# EasyEDA Pro project main_control.eprj

# Schematic main_control
Board Name: main_control; Create Date: 2024-08-07; Page Name: SCH_main_control; Project Name: main_control; Schematic Name: main_control; Update Date: 2024-08-19; Add into BOM: yes; Convert to PCB: yes; Date: 2024-08-03; Draw By: LBZ; REV: 1.0; Sheet: 1/1
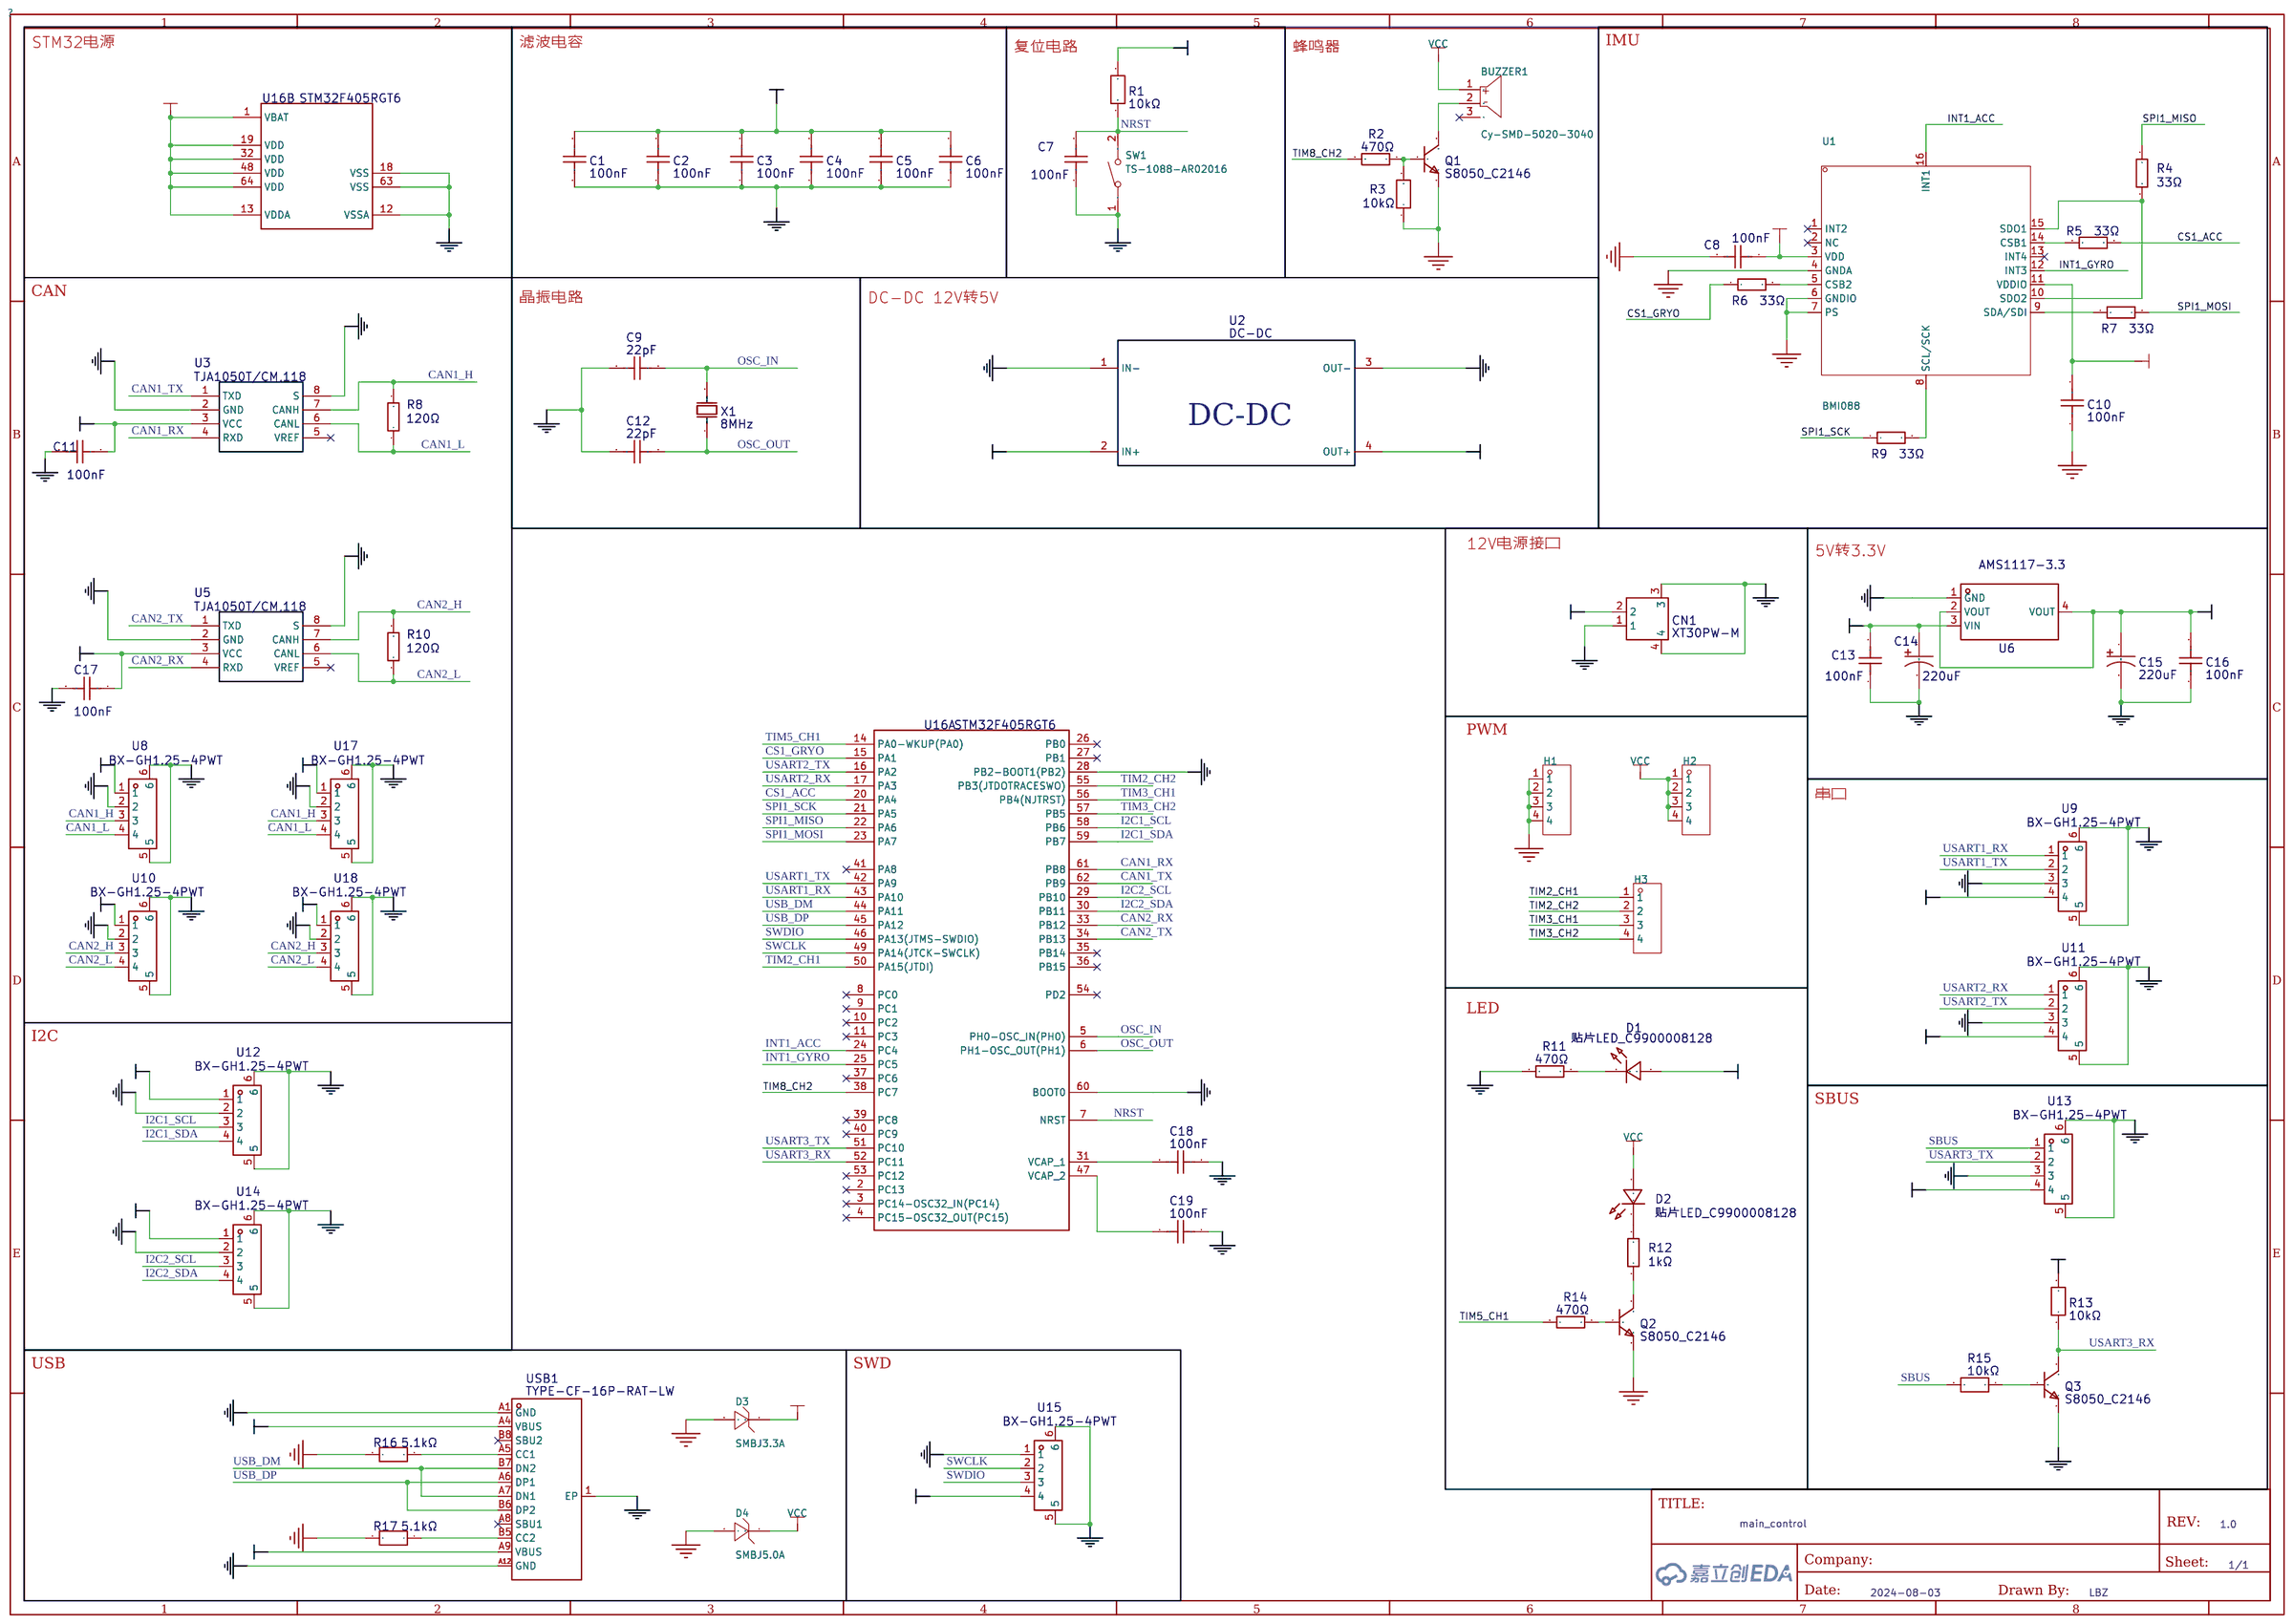
[diagram p0: schematic sheet]

## Parts
BUZZER1  Cy-SMD-5020-3040  [BUZ-SMD_CY-SMD-5020-3040]
C1  100nF  [C0603]
C2  100nF  [C0603]
C3  100nF  [C0603]
C4  100nF  [C0603]
C5  100nF  [C0603]
C6  100nF  [C0603]
C7  100nF  [C0603]
C8  100nF  [C0603]
C9  22pF  [C0603]
C10  100nF  [C0603]
C11  100nF  [C0603]
C12  22pF  [C0603]
C13  100nF  [C0603]
C14  220uF  [CAP-SMD_BD6.3-L6.6-W6.6-FD]
C15  220uF  [CAP-SMD_BD6.3-L6.6-W6.6-FD]
C16  100nF  [C0603]
C17  100nF  [C0603]
C18  100nF  [C0603]
C19  100nF  [C0603]
CN1  XT30PW-M  [CONN-TH_XT30PW-M]
D1  贴片LED_C9900008128  [LED0603-RD]
D2  贴片LED_C9900008128  [LED0603-RD]
D3  SMBJ3.3A  [SMB_L4.6-W3.6-LS5.3-RD]
D4  SMBJ5.0A  [SMB_L4.6-W3.6-LS5.3-RD]
H1  KH-2.54PH180-1X4P-L11.5  [HDR-TH_4P-P2.54-V-M]
H2  KH-2.54PH180-1X4P-L11.5  [HDR-TH_4P-P2.54-V-M]
H3  KH-2.54PH180-1X4P-L11.5  [HDR-TH_4P-P2.54-V-M]
Q1  S8050_C2146  [SOT-23-3_L3.0-W1.7-P0.95-LS2.9-BR]
Q2  S8050_C2146  [SOT-23-3_L3.0-W1.7-P0.95-LS2.9-BR]
Q3  S8050_C2146  [SOT-23-3_L3.0-W1.7-P0.95-LS2.9-BR]
R1  10kΩ  [R0603]
R2  470Ω  [R0805]
R3  10kΩ  [R0603]
R4  33Ω  [R0805]
R5  33Ω  [R0805]
R6  33Ω  [R0805]
R7  33Ω  [R0805]
R8  120Ω  [R0805]
R9  33Ω  [R0805]
R10  120Ω  [R0805]
R11  470Ω  [R0805]
R12  1kΩ  [R0805]
R13  10kΩ  [R0603]
R14  470Ω  [R0805]
R15  10kΩ  [R0603]
R16  5.1kΩ  [R0603]
R17  5.1kΩ  [R0603]
SW1  TS-1088-AR02016  [SW-SMD_L3.9-W3.0-P4.45]
U1  BMI088  [LGA-16_L4.5-W3.0-P0.50-BL]
U2  DC-DC  [DC-DC]
U3  TJA1050T/CM,118  [SOIC-8_L5.0-W4.0-P1.27-LS6.0-BL]
U5  TJA1050T/CM,118  [SOIC-8_L5.0-W4.0-P1.27-LS6.0-BL]
U6  AMS1117-3.3  [SOT-223-3_L6.5-W3.4-P2.30-LS7.0-BR]
U8  BX-GH1.25-4PWT  [CONN-SMD_4P-P1.25_BX-GH1.25-4PWT]
U9  BX-GH1.25-4PWT  [CONN-SMD_4P-P1.25_BX-GH1.25-4PWT]
U10  BX-GH1.25-4PWT  [CONN-SMD_4P-P1.25_BX-GH1.25-4PWT]
U11  BX-GH1.25-4PWT  [CONN-SMD_4P-P1.25_BX-GH1.25-4PWT]
U12  BX-GH1.25-4PWT  [CONN-SMD_4P-P1.25_BX-GH1.25-4PWT]
U13  BX-GH1.25-4PWT  [CONN-SMD_4P-P1.25_BX-GH1.25-4PWT]
U14  BX-GH1.25-4PWT  [CONN-SMD_4P-P1.25_BX-GH1.25-4PWT]
U15  BX-GH1.25-4PWT  [CONN-SMD_4P-P1.25_BX-GH1.25-4PWT]
U16  STM32F405RGT6  [LQFP-64_L10.0-W10.0-P0.50-LS12.0-BL]  (sections 1,2)
U17  BX-GH1.25-4PWT  [CONN-SMD_4P-P1.25_BX-GH1.25-4PWT]
U18  BX-GH1.25-4PWT  [CONN-SMD_4P-P1.25_BX-GH1.25-4PWT]
USB1  TYPE-CF-16P-RAT-LW  [TYPE-C-SMD_TYPE-CF-16P-RAT-LW]
X1  8MHz  [HC-49US_L11.5-W4.5-P4.88]

## Library data of the parts
BUZZER1 = Cy-SMD-5020-3040: LCSC Part Name: 电磁式无源蜂鸣器; Supplier Part: C968743; Manufacturer: CY(超音); Supplier Footprint: SMD,5x5mm; JLCPCB Part Class: 扩展库; Datasheet: https://atta.szlcsc.com/upload/public/pdf/source/20201211/C968743_12341BB1A92EB878772B5F362B4887DE.pdf; Supplier: LCSC
C1-C8 C10 C11 C13 C16-C19 = 100nF: Supplier: LCSC; Supplier Part: C2266794; Manufacturer: Knowles(楼氏); Manufacturer Part: 0603J0250104KXR; JLCPCB Part Class: Extended Part
C9 C12 = 22pF: Supplier: LCSC; Supplier Part: C2266794; Manufacturer: Knowles(楼氏); Manufacturer Part: 0603J0250104KXR; JLCPCB Part Class: Extended Part
C14 C15 = 220uF: Supplier: LCSC; Supplier Part: C165593; Manufacturer: SAMYOUNG(韩国三莹); Manufacturer Part: MVK 16V220M 6.3*8 6.3TP; JLCPCB Part Class: Extended Part
CN1 = XT30PW-M: Supplier: LCSC; Supplier Part: C431092; Manufacturer: AMASS(艾迈斯); JLCPCB Part Class: Extended Part
D1 D2 = 贴片LED_C9900008128: Supplier: LCSC; Supplier Part: C9900008128; Manufacturer: null; Manufacturer Part: 贴片LED
D3 = SMBJ3.3A_C362089: LCSC Part Name: 单向TVS 3.3V截止 600W峰值脉冲功率; Supplier Part: C113974; Manufacturer: JKSEMI(金开盛); Supplier Footprint: SMB(DO-214AA); JLCPCB Part Class: 扩展库; Datasheet: https://atta.szlcsc.com/upload/public/pdf/source/20200731/C362089_3B984BF84356FE4A5051ADB3F5B1E766.pdf; Supplier: LCSC; Reverse Stand-Off Voltage (Vrwm): 3.3V; Maximum Clamping Voltage: 7.3V; Peak Pulse Power Dissipation (Ppp)@10/1000us: 600W; Breakdown Voltage: 4.1V; Type: TVS
D4 = SMBJ5.0A_C113974: LCSC Part Name: TVS 5V截止 65.22A峰值脉冲; Supplier Part: C113974; Manufacturer: MDD; Supplier Footprint: SMB(DO-214AA); JLCPCB Part Class: 扩展库; Datasheet: https://atta.szlcsc.com/upload/public/pdf/source/20230314/C8F66EF07395B88C11214ABD10019202.pdf; Supplier: LCSC; Reverse Stand-Off Voltage (Vrwm): 5V; Maximum Clamping Voltage: 9.2V; Peak Pulse Current (Ipp)@10/1000us: 65.2A; Breakdown Voltage: 6.4V; Type: TVS
H1-H3 = KH-2.54PH180-1X4P-L11.5: LCSC Part Name: 间距:2.54mm 1x4P 直插 方针; Supplier Part: C2905435; Manufacturer: kinghelm(金航标); Supplier Footprint: 插件,P=2.54mm; JLCPCB Part Class: 扩展库; Datasheet: https://atta.szlcsc.com/upload/public/pdf/source/20211019/06FD9EA041E66F176E900F61FE678D35.pdf; Supplier: LCSC; Pin Structure: 1x4P; Pitch: 2.54mm; Circluar Pins/Square Pins: 方针; Mounting Type: 直插; Number of Rows: 单排; Number of Pins: 4P; Current Rating (Max): 3A; Length of Mating Pin: 6mm; Insulation Height: 2.5mm; Length of End Connection Pin: 3mm; Operating Temperature Range: -40℃~+105℃; Color: 黑色
Q1-Q3 = S8050_C2146: Supplier: LCSC; Manufacturer: CJ(江苏长电/长晶); Manufacturer Part: S8050 J3Y; Supplier Part: C2146; JLCPCB Part Class: Basic Part
R1 R3 R13 R15-R17 = 10kΩ: Supplier: LCSC; Supplier Part: C20138101; Manufacturer: VISHAY(威世); Manufacturer Part: MCT0603MG1002BP500; JLCPCB Part Class: Extended Part
R2 R4-R7 R9 R11 R12 R14 = 1kΩ: Supplier: LCSC; Manufacturer: YAGEO(国巨); Manufacturer Part: RC0805FR-07120RL; Supplier Part: C114245; JLCPCB Part Class: Extended Part
R8 R10 = 120Ω: Supplier: LCSC; Manufacturer: YAGEO(国巨); Manufacturer Part: RC0805FR-07120RL; Supplier Part: C114245; JLCPCB Part Class: Extended Part
SW1 = TS-1088-AR02016: LCSC Part Name: 4*3*2mm 立贴 轻触开关; Supplier Part: C720477; Manufacturer: XUNPU(讯普); Supplier Footprint: SMD; JLCPCB Part Class: 扩展库; Datasheet: https://atta.szlcsc.com/upload/public/pdf/source/20200810/C720475_60D09DD6C54279ADDB2DC25100F1CC11.pdf; Supplier: LCSC; Circuit: 单刀单掷; Actuator Style: 圆形按钮; Operating Force: 160gf; Mounting Style: 立贴; Switch Length: 4mm; Switch Width: 3mm; Switch Height: 2mm; Strike Gundam: 不带; Contact Current: 50mA; Voltage Rating (DC): 12V; Insulation Resistance: 100MΩ; Actuator/Cap Color: 黑色; Pin Style: SMD接片; Mechanical Life: 10万次; Operating Temperature: -30℃~+80℃
U1 = BMI088: Supplier Part: C194919; Manufacturer: Bosch(博世); Supplier Footprint: LGA-16(3x4.5); JLCPCB Part Class: 扩展库; Datasheet: https://atta.szlcsc.com/upload/public/pdf/source/20180628/C194919_66CCF125FF968C218A4D358C68AC68D6.pdf; Supplier: LCSC; Sensor Type: 加速度计陀螺仪; Operating Temperature: -40℃~+85℃
U2 = DC-DC: Supplier Part: C2875440
U3 U5 = TJA1050T/CM,118: Supplier: LCSC; Manufacturer: NXP(恩智浦); Supplier Part: C6952; JLCPCB Part Class: Extended Part
U6 = AMS1117-3.3: Supplier: LCSC; Manufacturer: AMS; Supplier Part: C6186; JLCPCB Part Class: Basic Part
U8-U15 U17 U18 = BX-GH1.25-4PWT: Supplier: LCSC; Supplier Part: C18077720; Manufacturer: Bossie(博锡); JLCPCB Part Class: Extended Part
U16 = STM32F405RGT6: tags: STM32; image: http://image.lceda.cn/szlcsc/C15742.jpg; Supplier Part: C15742; Supplier: LCSC; Manufacturer: ST(意法半导体); JLCPCB Part Class: Extended Part
USB1 = TYPE-CF-16P-RAT-LW: Supplier: LCSC; Supplier Part: C9900026770; Manufacturer: null; JLCPCB Part Class: Extended Part
X1 = 8MHz: Supplier: LCSC; Manufacturer: HOSONIC(鸿星); Manufacturer Part: E49A20E00000EE10C0; Supplier Part: C116096; JLCPCB Part Class: Extended Part

## Nets
GND: C1.1 C2.1 C3.1 C4.1 C5.1 C6.1 C7.1 C8.2 C9.2 C10.1 C11.2 C12.2 C13.1 C14.2 C15.2 C16.1 C17.2 C18.1 C19.1 D3.2 D4.2(A) H1.1 H1.2 H1.3 H1.4 Q1.2(E) Q2.2(E) Q3.2(E) R3.1 R11.2 R16.2 R17.2 SW1.1 U1.4(GNDA) U1.6(GNDIO) U1.7(PS) U2.3(OUT-) U3.2(GND) U3.8(S) U5.2(GND) U5.8(S) U6.1(GND) U8.2 U8.5 U8.6 U9.3 U9.5 U9.6 U10.2 U10.5 U10.6 U11.3 U11.5 U11.6 U12.2 U12.5 U12.6 U13.3 U13.5 U13.6 U14.2 U14.5 U14.6 U15.1 U15.5 U15.6 U16.12(VSSA) U16.18(VSS) U16.28(PB2-BOOT1(PB2)) U16.60(BOOT0) U16.63(VSS) U17.2 U17.5 U17.6 U18.2 U18.5 U18.6 USB1.1(EP) USB1.A1(GND) USB1.A12(GND)
PGND: CN1.1 CN1.3 CN1.4 U2.1(IN-)
VCC: BUZZER1.1 C11.1 C13.2 C14.1 C17.1 D2.2 D4.1(C) H2.1 H2.2 H2.3 H2.4 U2.4(OUT+) U3.3(VCC) U5.3(VCC) U6.3(VIN) U8.1 U9.4 U10.1 U11.4 U12.1 U13.4 U14.1 U17.1 U18.1 USB1.A4(VBUS) USB1.A9(VBUS)
VCC3.3: C1.2 C2.2 C3.2 C4.2 C5.2 C6.2 C8.1 C10.2 C15.1 C16.2 D1.2 D3.1 R1.2 R13.2 U1.3(VDD) U1.11(VDDIO) U6.2(VOUT) U6.4(VOUT) U15.4 U16.1(VBAT) U16.13(VDDA) U16.19(VDD) U16.32(VDD) U16.48(VDD) U16.64(VDD)
VCC12V: CN1.2 U2.2(IN+)
CAN1_H: R8.2 U3.7(CANH) U8.3 U17.3
CAN1_L: R8.1 U3.6(CANL) U8.4 U17.4
CAN1_RX: U3.4(RXD) U16.61(PB8)
CAN1_TX: U3.1(TXD) U16.62(PB9)
CAN2_H: R10.2 U5.7(CANH) U10.3 U18.3
CAN2_L: R10.1 U5.6(CANL) U10.4 U18.4
CAN2_RX: U5.4(RXD) U16.33(PB12)
CAN2_TX: U5.1(TXD) U16.34(PB13)
CS1_ACC: R5.2 U16.20(PA4)
CS1_GRYO: R6.1 U16.15(PA1)
I2C1_SCL: U12.3 U16.58(PB6)
I2C1_SDA: U12.4 U16.59(PB7)
I2C2_SCL: U14.3 U16.29(PB10)
I2C2_SDA: U14.4 U16.30(PB11)
INT1_ACC: U1.16(INT1) U16.24(PC4)
INT1_GYRO: U1.12(INT3) U16.25(PC5)
NRST: C7.2 R1.1 SW1.2 U16.7(NRST)
OSC_IN: C9.1 U16.5(PH0-OSC_IN(PH0)) X1.2(OSC2)
OSC_OUT: C12.1 U16.6(PH1-OSC_OUT(PH1)) X1.1(OSC1)
SBUS: R15.2 U13.1
SPI1_MISO: R4.1 U16.22(PA6)
SPI1_MOSI: R7.2 U16.23(PA7)
SPI1_SCK: R9.1 U16.21(PA5)
SWCLK: U15.2 U16.49(PA14(JTCK-SWCLK))
SWDIO: U15.3 U16.46(PA13(JTMS-SWDIO))
TIM2_CH1: H3.1 U16.50(PA15(JTDI))
TIM2_CH2: H3.2 U16.55(PB3(JTDOTRACESWO))
TIM3_CH1: H3.3 U16.56(PB4(NJTRST))
TIM3_CH2: H3.4 U16.57(PB5)
TIM5_CH1: R14.2 U16.14(PA0-WKUP(PA0))
TIM8_CH2: R2.2 U16.38(PC7)
USART1_RX: U9.1 U16.43(PA10)
USART1_TX: U9.2 U16.42(PA9)
USART2_RX: U11.1 U16.17(PA3)
USART2_TX: U11.2 U16.16(PA2)
USART3_RX: Q3.3(C) R13.1 U16.52(PC11)
USART3_TX: U13.2 U16.51(PC10)
USB_DM: U16.44(PA11) USB1.A7(DN1) USB1.B7(DN2)
USB_DP: U16.45(PA12) USB1.A6(DP1) USB1.B6(DP2)
$1N19: C18.2 U16.31(VCAP_1)
$1N20: C19.2 U16.47(VCAP_2)
$1N101: Q3.1(B) R15.1
$1N156: D1.1 R11.1
$1N7742: R16.1 USB1.A5(CC1)
$1N7746: R17.1 USB1.B5(CC2)
$1N8341: R9.2 U1.8(SCL/SCK)
$1N8349: R7.1 U1.9(SDA/SDI)
$1N8356: R4.2 U1.10(SDO2) U1.15(SDO1)
$1N8768: R5.1 U1.14(CSB1)
$1N8804: R6.2 U1.5(CSB2)
$1N9285: Q2.1(B) R14.1
$1N9312: Q2.3(C) R12.2
$1N9338: D2.1 R12.1
$1N9545: BUZZER1.2 Q1.3(C)
$1N9603: Q1.1(B) R2.1 R3.2

Not connected (* = marked no-connect by the designer): BUZZER1 3*; U1 1(INT2)* 2(NC)* 13(INT4)*; U3 5(VREF)*; U5 5(VREF)*; U16 2(PC13)* 3(PC14-OSC32_IN(PC14))* 4(PC15-OSC32_OUT(PC15))* 8(PC0)* 9(PC1)* 10(PC2)* 11(PC3)* 26(PB0)* 27(PB1)* 35(PB14)* 36(PB15)* 37(PC6)* 39(PC8)* 40(PC9)* 41(PA8)* 53(PC12)* 54(PD2)*; USB1 A8(SBU1)* B8(SBU2)*

## Notes on the sheet
- STM32电源
- 滤波电容
- IMU
- 复位电路
- 蜂鸣器
- CAN
- 晶振电路
- DC-DC 12V转5V
- 12V电源接口
- 5V转3.3V
- PWM
- 串口
- LED
- I2C
- SBUS
- USB
- SWD

# Board PCB_main_control
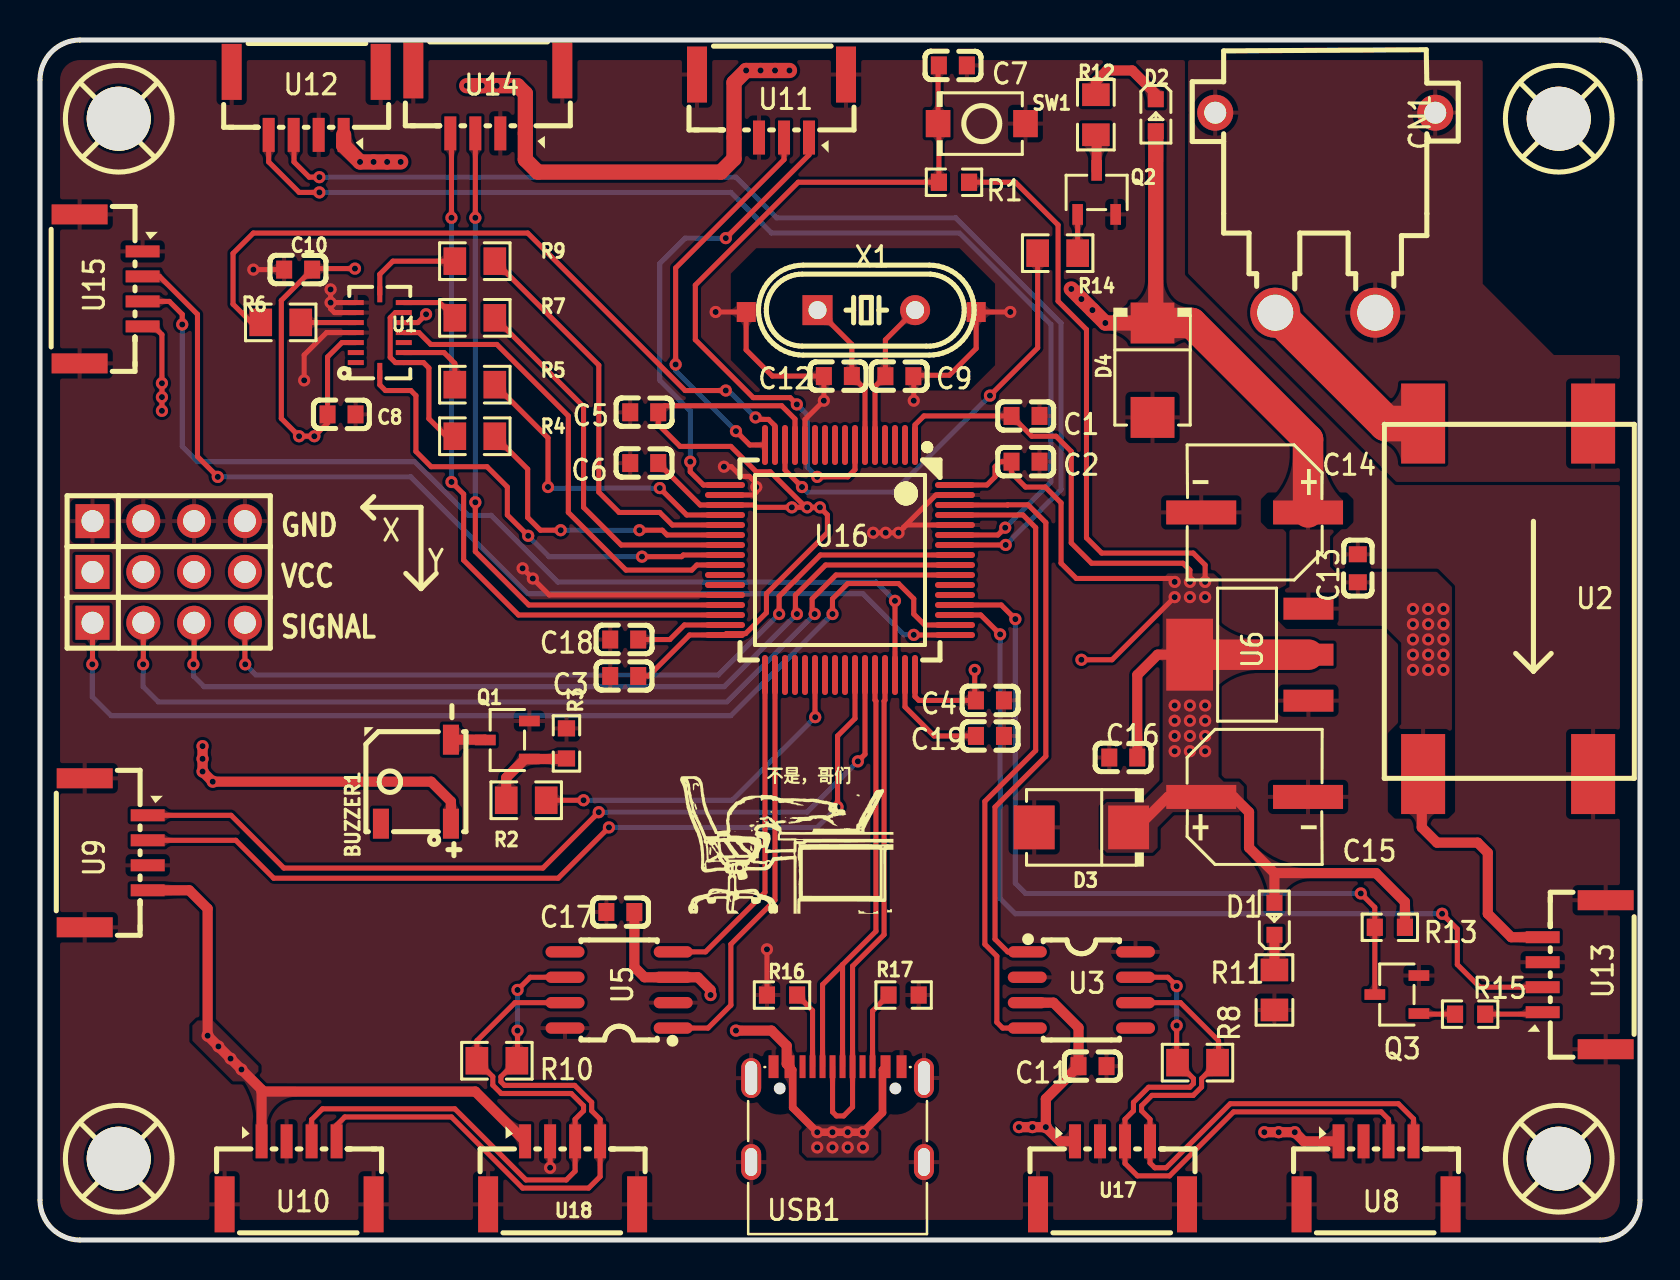
[diagram p1: board, top side]
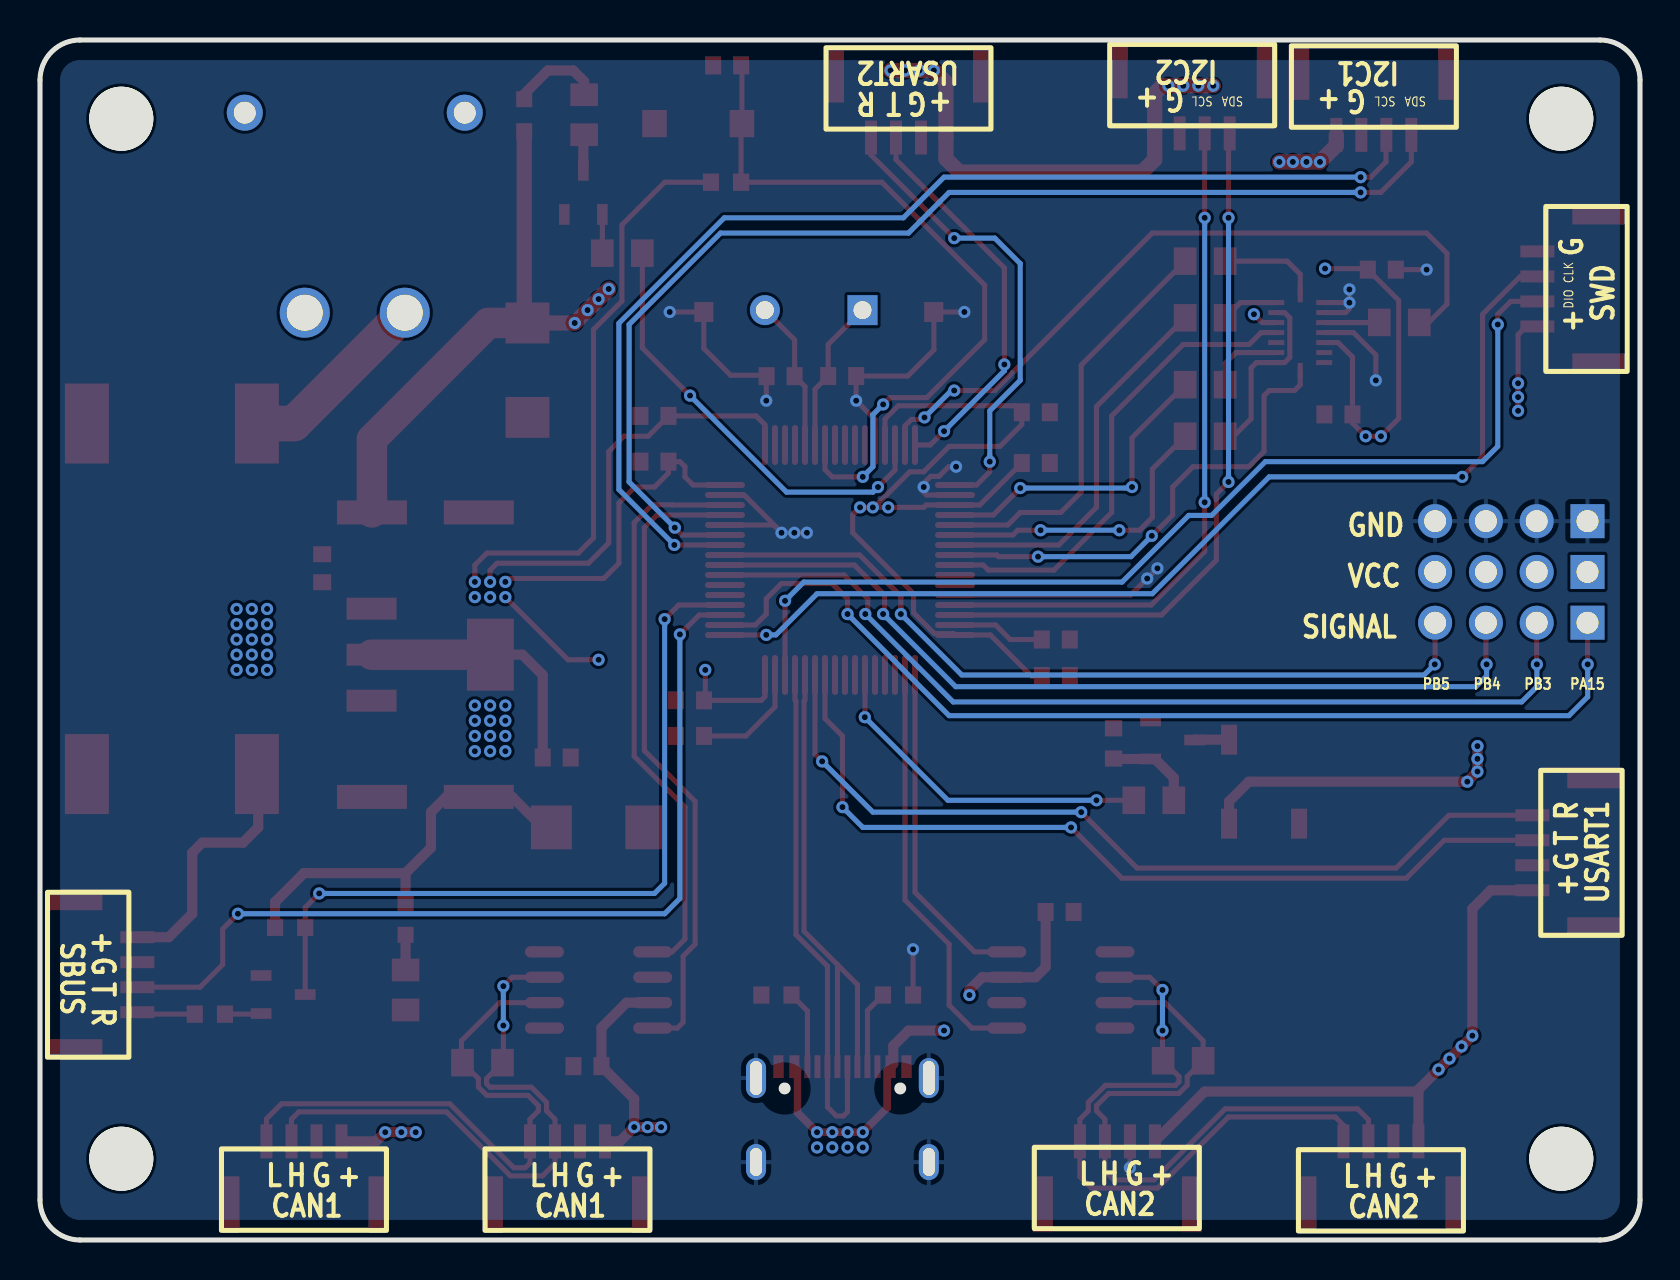
[diagram p2: board, bottom side, seen from below]

Outline 80 x 60 mm; copper layers: Top Layer, Inner1, Inner2, Bottom Layer. Coordinates in mm from the lower left corner of the outline.
Outline path: 0,58 0,2 arc(0.59,0.59) 2,0 78,0 arc(79.41,0.59) 80,2 80,58 arc(79.41,59.41) 78,60 2,60 arc(0.59,59.41) 0,58
Stack: Top Layer 0.035mm 外层铜厚1oz / Dielectric1 0.2104mm 7628 RC49% 8.6mil / Inner1 0.0152mm 内层铜厚 / Dielectric2 1.065mm 1.1mm H/HOZ Copper / Inner2 0.0152mm 内层铜厚 / Dielectric3 0.2104mm 7628 RC49% 8.6mil / Bottom Layer 0.035mm 外层铜厚1oz

## Design rules (mm)
net USB_DP: USB
net USB_DM: USB
net CAN2_H: CAN2
net CAN1_H: CAN1
net CAN1_L: CAN1
net CAN2_L: CAN2
template: 用户自定义配置
spacing Default (default): track to track 0.152, other pairs 0 to 1.001
track width Default (default): min 0.254, default 0.254, max 25.4
differential pair differentialPair (default): width min 0.127, default 0.254, max 2.54; gap min 0.152, default 0.152
via Default (default): diameter min 0.61, default 0.61, max 100.025; hole min 0.305, default 0.305, max 59.995

## Placement (name value [footprint] x y rotation side)
BUZZER1  Cy-SMD-5020-3040  [BUZ-SMD_CY-SMD-5020-3040]  18.8 22.92 90 top
C1  100nF  [C0603]  49.28 41.2 180 top
C2  100nF  [C0603]  49.28 38.92 180 top
C3  100nF  [C0603]  29.21 28.2 0 top
C4  100nF  [C0603]  47.5 26.98 180 top
C5  100nF  [C0603]  30.21 41.39 0 top
C6  100nF  [C0603]  30.21 38.85 0 top
C7  100nF  [C0603]  45.64 58.73 180 top
C8  100nF  [C0603]  15.08 41.28 0 top
C9  22pF  [C0603]  42.97 43.19 0 top
C10  100nF  [C0603]  12.91 48.52 0 top
C11  100nF  [C0603]  52.63 8.69 0 top
C12  22pF  [C0603]  39.89 43.2 180 top
C13  100nF  [C0603]  65.89 33.59 270 top
C14  220uF  [CAP-SMD_BD6.3-L6.6-W6.6-FD]  60.73 36.38 180 top
C15  220uF  [CAP-SMD_BD6.3-L6.6-W6.6-FD]  60.73 22.15 0 top
C16  100nF  [C0603]  54.16 24.12 0 top
C17  100nF  [C0603]  29.02 16.4 180 top
C18  100nF  [C0603]  29.21 30.02 0 top
C19  100nF  [C0603]  47.5 25.2 180 top
CN1  XT30PW-M  [CONN-TH_XT30PW-M]  64.26 51.36 180 top
D1  贴片LED_C9900008128  [LED0603-RD]  61.72 16.06 90 top
D2  贴片LED_C9900008128  [LED0603-RD]  55.79 56.24 270 top
D3  SMBJ3.3A  [SMB_L4.6-W3.6-LS5.3-RD]  52.07 20.63 180 top
D4  SMBJ5.0A  [SMB_L4.6-W3.6-LS5.3-RD]  55.63 43.49 270 top
H1  KH-2.54PH180-1X4P-L11.5  [HDR-TH_4P-P2.54-V-M]  6.44 35.94 0 top
H2  KH-2.54PH180-1X4P-L11.5  [HDR-TH_4P-P2.54-V-M]  6.44 33.4 0 top
H3  KH-2.54PH180-1X4P-L11.5  [HDR-TH_4P-P2.54-V-M]  6.44 30.86 0 top
NOREF  -  [Pad_e340]  35.31 46.4 270 top
NOREF#2  -  [Pad_e1722]  46.81 46.4 90 top
Q1  S8050_C2146  [SOT-23-3_L3.0-W1.7-P0.95-LS2.9-BR]  23.37 25 0 top
Q2  S8050_C2146  [SOT-23-3_L3.0-W1.7-P0.95-LS2.9-BR]  52.83 52.38 270 top
Q3  S8050_C2146  [SOT-23-3_L3.0-W1.7-P0.95-LS2.9-BR]  67.84 12.27 0 top
R1  10kΩ  [R0603]  45.7 52.89 0 top
R2  470Ω  [R0805]  24.31 21.99 0 top
R3  10kΩ  [R0603]  26.32 24.83 270 top
R4  33Ω  [R0805]  21.74 40.19 180 top
R5  33Ω  [R0805]  21.74 42.77 0 top
R6  33Ω  [R0805]  12.04 45.88 0 top
R7  33Ω  [R0805]  21.74 46.11 0 top
R8  120Ω  [R0805]  57.88 8.87 180 top
R9  33Ω  [R0805]  21.74 48.94 180 top
R10  120Ω  [R0805]  22.84 8.96 180 top
R11  470Ω  [R0805]  61.72 12.5 270 top
R12  1kΩ  [R0805]  52.79 56.26 270 top
R13  10kΩ  [R0603]  67.49 15.64 0 top
R14  470Ω  [R0805]  50.88 49.34 180 top
R15  10kΩ  [R0603]  71.51 11.29 0 top
R16  5.1kΩ  [R0603]  37.1 12.25 180 top
R17  5.1kΩ  [R0603]  43.18 12.25 0 top
SCREW1  -  [M3螺丝]  4 4 0 top
SCREW2  -  [M3螺丝]  4 56 0 top
SCREW3  -  [M3螺丝]  76 56 0 top
SCREW4  -  [M3螺丝]  76 4 0 top
SW1  TS-1088-AR02016  [SW-SMD_L3.9-W3.0-P4.45]  47.09 55.82 180 top
U1  BMI088  [LGA-16_L4.5-W3.0-P0.50-BL]  16.99 45.37 0 top
U2  -  [DC-DC]  73.41 32.06 270 top
U3  TJA1050T/CM,118  [SOIC-8_L5.0-W4.0-P1.27-LS6.0-BL]  52.07 12.5 270 top
U5  TJA1050T/CM,118  [SOIC-8_L5.0-W4.0-P1.27-LS6.0-BL]  28.96 12.5 90 top
U6  AMS1117-3.3  [SOT-223-3_L6.5-W3.4-P2.30-LS7.0-BR]  60.45 29.27 0 top
U8  BX-GH1.25-4PWT  [CONN-SMD_4P-P1.25_BX-GH1.25-4PWT]  66.8 3.36 0 top
U9  BX-GH1.25-4PWT  [CONN-SMD_4P-P1.25_BX-GH1.25-4PWT]  3.81 19.36 270 top
U10  BX-GH1.25-4PWT  [CONN-SMD_4P-P1.25_BX-GH1.25-4PWT]  12.95 3.36 0 top
U11  BX-GH1.25-4PWT  [CONN-SMD_4P-P1.25_BX-GH1.25-4PWT]  36.58 56.7 180 top
U12  BX-GH1.25-4PWT  [CONN-SMD_4P-P1.25_BX-GH1.25-4PWT]  13.31 56.83 180 top
U13  BX-GH1.25-4PWT  [CONN-SMD_4P-P1.25_BX-GH1.25-4PWT]  76.71 13.26 90 top
U14  BX-GH1.25-4PWT  [CONN-SMD_4P-P1.25_BX-GH1.25-4PWT]  22.39 56.91 180 top
U15  BX-GH1.25-4PWT  [CONN-SMD_4P-P1.25_BX-GH1.25-4PWT]  3.56 47.55 270 top
U16  STM32F405RGT6  [LQFP-64_L10.0-W10.0-P0.50-LS12.0-BL]  40 34 180 top
U17  BX-GH1.25-4PWT  [CONN-SMD_4P-P1.25_BX-GH1.25-4PWT]  53.63 3.36 0 top
U18  BX-GH1.25-4PWT  [CONN-SMD_4P-P1.25_BX-GH1.25-4PWT]  26.13 3.36 0 top
USB1  TYPE-CF-16P-RAT-LW  [TYPE-C-SMD_TYPE-CF-16P-RAT-LW]  39.88 6.28 0 top
X1  8MHz  [HC-49US_L11.5-W4.5-P4.88]  41.32 46.49 0 top

## Footprints (pads in the part's own frame, mm; a bottom-side part is the same pattern mirrored in y, then rotated)
BUZ-SMD_CY-SMD-5020-3040
  rect 1.5x0.8 smd: 1(-2.1,-1.75) 2(2.1,-1.75) 3(-2.1,1.75)
C0603
  rect 0.8x0.9 smd: 1(-0.7,0) 2(0.7,0)
CAP-SMD_BD6.3-L6.6-W6.6-FD
  rect 3.5x1.2 smd: 1(-2.67,0) 2(2.67,0)
CONN-SMD_4P-P1.25_BX-GH1.25-4PWT
  rect 0.6x1.7 smd: 1(-1.875,1.575) 2(-0.625,1.575) 3(0.625,1.575) 4(1.875,1.575)
  rect 1x2.8 smd: 5(3.725,-1.575) 6(-3.725,-1.575)
CONN-TH_XT30PW-M
  round 2.5 hole 1.8: 1(-2.5,5) 2(2.5,5)
  round 1.8 hole 1.1: 3(5.5,-5) 4(-5.5,-5)
DC-DC
  rect 4x2.2 smd: 1(-8.763,4.25) 2(-8.763,-4.25) 3(8.763,4.25) 4(8.763,-4.25)
HC-49US_L11.5-W4.5-P4.88
  rect 1.5x1.5 hole 0.9: 1(-2.44,0)
  round 1.5 hole 0.9: 2(2.44,0)
HDR-TH_4P-P2.54-V-M
  rect 1.7x1.7 hole 1.1: 1(-3.81,0)
  round 1.7 hole 1.1: 2(-1.27,0) 3(1.27,0) 4(3.81,0)
LED0603-RD
  rect 0.8x0.8 smd: 1(-0.799,0) 2(0.799,0)
LGA-16_L4.5-W3.0-P0.50-BL
  rect 0.8x0.25 smd: 1(-1.2,-1.498) 2(-1.2,-0.998) 3(-1.2,-0.498) 4(-1.2,0.002) 5(-1.2,0.502) 6(-1.2,1.002) 7(-1.2,1.502) 9(1.2,1.502) 10(1.2,1.002) 11(1.2,0.502) 12(1.2,0.002) 13(1.2,-0.498) 14(1.2,-0.998) 15(1.2,-1.498)
  rect 0.25x0.8 smd: 8(0,1.915) 16(0,-1.915)
LQFP-64_L10.0-W10.0-P0.50-LS12.0-BL
  oval 0.3x2 smd: 1(-3.75,-5.75) 2(-3.25,-5.75) 3(-2.75,-5.75) 4(-2.25,-5.75) 5(-1.75,-5.75) 6(-1.25,-5.75) 7(-0.75,-5.75) 8(-0.25,-5.75) 9(0.25,-5.75) 10(0.75,-5.75) 11(1.25,-5.75) 12(1.75,-5.75) 13(2.25,-5.75) 14(2.75,-5.75) 15(3.25,-5.75) 16(3.75,-5.75) 33(3.75,5.75) 34(3.25,5.75) 35(2.75,5.75) 36(2.25,5.75) 37(1.75,5.75) 38(1.25,5.75) 39(0.75,5.75) 40(0.25,5.75) 41(-0.25,5.75) 42(-0.75,5.75) 43(-1.25,5.75) 44(-1.75,5.75) 45(-2.25,5.75) 46(-2.75,5.75) 47(-3.25,5.75) 48(-3.75,5.75)
  oval 2x0.3 smd: 17(5.75,-3.75) 18(5.75,-3.25) 19(5.75,-2.75) 20(5.75,-2.25) 21(5.75,-1.75) 22(5.75,-1.25) 23(5.75,-0.75) 24(5.75,-0.25) 25(5.75,0.25) 26(5.75,0.75) 27(5.75,1.25) 28(5.75,1.75) 29(5.75,2.25) 30(5.75,2.75) 31(5.75,3.25) 32(5.75,3.75) 49(-5.75,3.75) 50(-5.75,3.25) 51(-5.75,2.75) 52(-5.75,2.25) 53(-5.75,1.75) 54(-5.75,1.25) 55(-5.75,0.75) 56(-5.75,0.25) 57(-5.75,-0.25) 58(-5.75,-0.75) 59(-5.75,-1.25) 60(-5.75,-1.75) 61(-5.75,-2.25) 62(-5.75,-2.75) 63(-5.75,-3.25) 64(-5.75,-3.75)
M3螺丝
  round 3.2 hole 3.2: 1(-0.064,0.064)
Pad_e340
  custom 1.002x0.955 smd: 1(0,0)
Pad_e1722
  custom 1.002x0.956 smd: 1(0,0)
R0603
  rect 0.806x0.864 smd: 1(-0.753,0) 2(0.753,0)
R0805
  rect 1.133x1.377 smd: 1(-1,0) 2(1,0)
SMB_L4.6-W3.6-LS5.3-RD
  rect 2.047x2.192 smd: 1(-2.361,0) 2(2.361,0)
SOIC-8_L5.0-W4.0-P1.27-LS6.0-BL
  oval 0.569x1.95 smd: 1(-1.905,-2.705) 2(-0.635,-2.705) 3(0.635,-2.705) 4(1.905,-2.705) 5(1.905,2.705) 6(0.635,2.705) 7(-0.635,2.705) 8(-1.905,2.705)
SOT-23-3_L3.0-W1.7-P0.95-LS2.9-BR
  rect 1.038x0.532 smd: 1(1.101,-0.95) 2(1.101,0.95) 3(-1.101,0)
SOT-223-3_L6.5-W3.4-P2.30-LS7.0-BR
  rect 2.5x1.1 smd: 1(2.97,-2.3) 2(2.97,0) 3(2.97,2.3)
  rect 2.34x3.6 smd: 4(-2.97,0)
SW-SMD_L3.9-W3.0-P4.45
  rect 1.23x1.36 smd: 1(-2.185,0) 2(2.185,0)
TYPE-C-SMD_TYPE-CF-16P-RAT-LW
  oval 1x2 hole 0.6x1.7: 1(-4.32,1.816) 1(4.32,1.816)
  oval 1x1.8 hole 0.6x1.4: 1(-4.32,-2.384) 1(4.32,-2.384)
  rect 0.5x1.14 smd: A1(-3.2,2.384) A4(-2.4,2.384) A9(2.4,2.384) A12(3.2,2.384)
  rect 0.3x1.14 smd: A5(-1.25,2.384) A6(-0.25,2.384) A7(0.25,2.384) A8(1.25,2.384) B5(1.75,2.384) B6(0.75,2.384) B7(-0.75,2.384) B8(-1.75,2.384)

## Nets
As in the schematic, except:
GND: C1.1 C2.1 C3.1 C4.1 C5.1 C6.1 C7.1 C8.2 C9.2 C10.1 C11.2 C12.2 C13.1 C14.2 C15.2 C16.1 C17.2 C18.1 C19.1 D3.2 D4.2 H1.1 H1.2 H1.3 H1.4 NOREF.1 NOREF#2.1 Q1.2 Q2.2 Q3.2 R3.1 R11.2 R16.2 R17.2 SW1.1 U1.4 U1.6 U1.7 U2.3 U3.2 U3.8 U5.2 U5.8 U6.1 U8.2 U8.5 U8.6 U9.3 U9.5 U9.6 U10.2 U10.5 U10.6 U11.3 U11.5 U11.6 U12.2 U12.5 U12.6 U13.3 U13.5 U13.6 U14.2 U14.5 U14.6 U15.1 U15.5 U15.6 U16.12 U16.18 U16.28 U16.60 U16.63 U17.2 U17.5 U17.6 U18.2 U18.5 U18.6 USB1.1 USB1.A1 USB1.A12

Pads without a net: BUZZER1 3; SCREW1 1; SCREW2 1; SCREW3 1; SCREW4 1; U1 1 2 13; U3 5; U5 5; U16 2 3 4 8 9 10 11 26 27 35 36 37 39 40 41 53 54; USB1 A8 B8

## Via types
v1: diameter 0.61, hole 0.305, Top Layer to Bottom Layer, 152 vias

## Routing (per net, layer and track width the routed paths; a pad name or vN(x,y) marks a point on that pad's centre or on a via; arc(x,y) is an arc through that point)
GND: length 55.4
  Top Layer w0.254: U1.7 14.53,46.87 v1(14.53,46.87) ; v1(13.21,42.98) 13.21,44.25 14.33,45.37 U1.4 ; R16.2 v1(36.35,14.53) ; v1(48.51,46.4) NOREF#2.1 46.81,44.58 45.47,43.24 43.71,43.24 C9.2 43.69,43.17 v1(43.69,41.97) ; U16.63 44.79,37.25 43.18,35.64 43.18,35.62 ; v1(33.78,46.4) NOREF.1 35.31,46.39 35.31,44.51 36.62,43.2 C12.2 v1(39.19,41.97) 38.25,41.02 U16.12 ; v1(34.2,38.66) 34.57,38.66 35.05,38.18 35.47,38.18 35.81,37.84 v1(35.81,37.65) 35.81,37.39 35.67,37.25 U16.18 ; 43.18,35.62 43.31,35.75 U16.60 ; 43.18,35.62 v1(42.93,35.36) v1(42.28,35.36) v1(41.66,35.36) ; v1(24.13,33.58) v1(24.64,33.07) 25.46,32.25 U16.28 ; v1(14.53,46.87) 14.53,46.56 14.72,46.37 U1.6 ; v1(14.53,46.87) v1(14.53,47.53) ; 25.51,4.93 v1(25.51,3.61) ; C10.1 v1(10.67,48.52)
VCC: length 188.9
  Top Layer w0.381: USB1.A4 37.63,8.51 37.63,6.62 v1(38.86,5.39) v1(41.15,5.39) 42.12,6.37 42.12,8.51 USB1.A9
  Top Layer w0.508: U17.1 51,4.93 v1(50.29,5.64) ; U3.3 50.67,11.87 51.93,10.61 C11.1 50.29,7.06 v1(50.29,5.64) ; v1(34.8,10.47) 36.58,10.47 37.33,9.71 37.33,8.81 USB1.A4 ; U8.1 63.19,4.93 v1(62.74,5.39) v1(61.93,5.39) v1(61.21,5.39) ; v1(50.29,5.64) v1(48.95,5.64) ; 11.08,7.42 11.08,7.52 v1(10.07,8.52) v1(9.53,9.07) v1(8.92,9.68) v1(8.38,10.22) 8.38,16.57 7.46,17.48 U9.4 ; 11.08,7.42 U10.1 ; 11.08,7.42 21.77,7.42 U18.1 ; v1(33.53,12.25) 33.53,12.5 32.89,13.14 U5.3 30.23,13.14 29.72,13.64 C17.1 ; U2.4 69.09,23.23 69.09,20.63 69.85,19.87 71.88,19.87 72.39,19.36 72.39,16.31 73.56,15.14 U13.4 ; BUZZER1.1 20.55,21.93 19.56,22.92 v1(8.64,22.92) v1(8.13,23.42) v1(8.13,24.06) v1(8.13,24.69)
  Top Layer w0.762: v1(37.47,58.48) v1(36.75,58.48) v1(36.03,58.48) v1(35.31,58.48) 34.7,57.87 34.7,54.06 34.04,53.4 24.89,53.4 24.27,54.02 24.27,57.32 23.88,57.71 v1(21.34,57.71) ; D2.2 55.79,46.01 D4.1 v1(53.27,45.85) v1(52.62,46.5) v1(52.07,47.05) v1(51.56,47.55) ; v1(18.03,53.9) v1(17.36,53.9) v1(16.68,53.9) v1(16,53.9) 15.18,54.72 U12.1
  Top Layer w1.524: C14.1 63.4,40.03 57.58,45.85 D4.1
  Inner2 w0.508: v1(34.8,10.47) 33.53,11.74 v1(33.53,12.25)
  Inner2 w0.762: v1(23.58,57.71) v1(22.83,57.71) v1(22.09,57.71) v1(21.34,57.71) 18.8,55.17 18.8,54.67 v1(18.03,53.9) v1(17.36,53.9) v1(16,53.9) ; v1(53.27,45.85) v1(52.62,46.5) v1(52.07,47.05) v1(51.56,47.55) 40.64,58.48 v1(37.47,58.48) v1(36.75,58.48) v1(36.03,58.48) v1(35.31,58.48) ; v1(8.38,10.22) v1(8.92,9.68) v1(9.53,9.07) v1(10.07,8.52)
  vias: v1(38.86,4.63) v1(39.62,5.39) v1(39.62,4.63) v1(40.39,5.39) v1(40.39,4.63) v1(41.15,4.63) v1(49.62,5.64) v1(68.65,31.55) v1(68.65,30.79) v1(68.65,30.03) v1(68.65,29.27) v1(68.65,28.5) v1(69.41,31.55) v1(69.41,30.79) v1(69.41,30.03) v1(69.41,29.27) v1(69.41,28.5) v1(70.17,31.55) v1(70.17,30.79) v1(70.17,30.03) v1(70.17,29.27) v1(70.17,28.5)
VCC3.3: length 188.4
  Top Layer w0.254: v1(6.1,41.46) v1(6.1,42.14) v1(6.1,42.84) 6.1,45.27 5.69,45.68 U15.4 ; C8.1 14.38,40.85 v1(13.72,40.19) v1(12.95,40.19) 12.06,41.08 12.06,46.98 C10.2 13.66,48.57 v1(15.75,48.57) ; C4.2 46.74,27.04 v1(46.74,28.5) ; U16.13 37.75,41.05 37.08,41.71 31.24,41.71 C5.2 30.91,40.77 32,39.68 34.54,39.68 35.81,38.41 36.51,38.41 38.29,36.63 ; v1(56.73,32.14) 53.6,29.01 v1(52.07,29.01) ; U16.1 43.75,40.76 44.2,41.2 C1.2 49.59,40.19 50.8,40.19 51.56,39.43 51.56,34.85 52.58,33.84 57.15,33.84 57.5,33.49 v1(57.5,32.91) ; 14.38,41.79 14.38,44.15 15.1,44.87 U1.3 ; R1.2 48.77,52.89 50.9,50.75 50.9,46.94 52.32,45.52 52.32,35.11 53.09,34.35 57.66,34.35 58.26,33.75 v1(58.26,32.91) ; C3.2 30.43,28.2 32.48,30.25 U16.32 34.32,30.32 35.28,30.32 36.32,31.36 36.32,32.32 39.37,35.37 39.37,36.26 v1(39,36.63) v1(38.36,36.63) 38.29,36.63 ; v1(56.73,32.91) 56.56,33.08 51.82,33.08 51.05,33.84 51.05,36.86 50.26,37.65 49.28,37.65 48.58,38.35 C2.2 48.01,38.92 47.75,38.66 47.75,38.16 47.35,37.75 U16.64 ; 38.29,36.63 v1(37.59,36.63) 35.81,36.63 35.7,36.75 U16.19 33.01,36.75 C6.2 ; v1(19.3,46.29) 19.3,46.28 18.89,45.87 U1.11 ; U16.48 43.75,27.17 43.94,26.98 46.8,26.98
  Top Layer w0.508: D3.1 54.86,20.63 56.39,22.15 C15.1 59.69,22.15 60.45,21.39 60.45,19.61 61.72,18.34 ; D1.2 61.72,18.34 ; 61.72,18.34 66.8,18.34 68.25,16.9 R13.2 ; U6.4 55.88,29.27 54.86,28.25 C16.2
  Top Layer w1.524: U6.2 U6.4
  Inner2 w0.254: v1(15.75,48.57) 18.54,48.57 19.3,47.81 v1(19.3,46.29) ; v1(52.07,29.01) 47.24,29.01 v1(46.74,28.5)
  vias: v1(56.73,26.73) v1(56.73,25.96) v1(56.73,25.2) v1(56.73,24.44) v1(57.5,32.14) v1(57.5,26.73) v1(57.5,25.96) v1(57.5,25.2) v1(57.5,24.44) v1(58.26,32.14) v1(58.26,26.73) v1(58.26,25.96) v1(58.26,25.2) v1(58.26,24.44)
VCC12V: length 9.7
  Top Layer w1.778: CN1.2 67.3,40.82 U2.2
CAN1_H: length 30.1
  Top Layer w0.254: v1(56.83,12.69) 56.39,13.14 U3.7 ; U8.3 67.43,6.04 67.06,6.41 59.68,6.41 56.48,3.21 54.87,3.21 54.25,3.83 54.25,6.04 54.67,6.46 54.67,6.88 55.43,7.64 57.49,7.64 57.67,7.82 57.67,8.07 R8.2 56.83,8.91 v1(56.83,10.72)
  Bottom Layer w0.254: v1(56.83,12.69) v1(56.83,10.72)
CAN1_L: length 30.1
  Top Layer w0.254: U3.6 57.02,11.87 58.93,9.96 58.93,8.92 R8.1 58.08,8.07 58.08,7.65 57.66,7.23 55.6,7.23 55.08,6.71 55.08,6.46 55.5,6.04 U17.4 55.5,3.85 55.74,3.61 56.31,3.61 59.51,6.81 67.92,6.81 68.68,6.06 U8.4
CAN1_RX: length 32
  Top Layer w0.254: U16.61 49.15,36.25 49.78,35.62 49.78,24.47 47.24,21.93 47.24,14.79 47.84,14.19 47.84,10.89 48.13,10.6 U3.4
CAN1_TX: length 28.7
  Top Layer w0.254: U3.1 48.39,14.41 47.75,15.04 47.75,21.65 50.29,24.19 50.29,35.87 49.4,36.76 48.39,36.76 48.38,36.75 U16.62
CAN2_H: length 32.3
  Top Layer w0.254: 26.25,11.87 23.75,11.87 21.84,9.96 R10.2 22.64,8.16 22.64,7.74 23.06,7.32 26.56,7.32 27.18,6.71 27.18,6.46 26.75,6.04 U18.3 26.75,3.44 26.31,3 24.3,3 20.74,6.56 14.12,6.56 13.58,6.01 U10.3
CAN2_L: length 32.3
  Top Layer w0.254: U10.4 14.83,5.74 15.24,6.15 20.57,6.15 24.13,2.6 27.43,2.6 28,3.17 U18.4 28,6.04 27.58,6.46 27.58,6.88 26.73,7.73 23.23,7.73 23.05,7.91 23.05,8.16 R10.1 23.88,8.99 v1(23.88,10.47) ; 26.25,13.14 24.51,13.14 v1(23.88,12.5)
  Bottom Layer w0.254: v1(23.88,12.5) v1(23.88,10.47)
CAN2_RX: length 16.7
  Top Layer w0.254: U5.4 33.27,14.41 36.25,17.38 U16.33
CAN2_TX: length 20.8
  Top Layer w0.254: U5.1 33.4,10.6 34.54,11.74 34.54,14.79 36.75,16.99 U16.34
CS1_ACC: length 15.6
  Top Layer w0.254: R5.2 25.4,40.11 v1(25.4,37.65) ; v1(30.99,37.6) 32.34,36.25 U16.20
  Bottom Layer w0.254: v1(25.4,37.65) 25.45,37.6 v1(30.99,37.6)
CS1_GRYO: length 36.8
  Top Layer w0.254: R6.1 10.56,45.88 9.65,46.79 9.65,49.33 10.67,50.35 24.38,50.35 32.26,42.47 v1(34.29,42.47) ; U16.15 36.75,40.71 36.43,41.03 35.88,41.03 v1(35.78,41.13)
  Bottom Layer w0.254: v1(35.78,41.13) 34.43,42.47 v1(34.29,42.47)
I2C1_SCL: length 57.8
  Top Layer w0.254: U12.3 12.7,55.24 12.7,53.9 13.46,53.14 v1(13.97,53.14) ; U16.58 48.28,34.75 v1(48.29,34.75)
  Bottom Layer w0.254: v1(13.97,53.14) 34.8,53.14 36.83,51.11 45.79,51.11 51.05,45.84 51.05,37.52 v1(48.29,34.75)
I2C1_SDA: length 57.6
  Top Layer w0.254: U16.59 47.89,35.25 v1(48.26,35.62) ; v1(13.97,52.38) 12.96,52.38 11.43,53.9 11.43,55.26
  Bottom Layer w0.254: v1(13.97,52.38) 34.54,52.38 36.58,50.35 45.97,50.35 50.55,45.78 50.55,37.9 v1(48.26,35.62)
I2C2_SCL: length 34.5
  Top Layer w0.254: v1(21.77,36.89) 21.77,34.42 24.44,31.75 U16.29 ; 21.77,55.33 v1(21.77,51.11)
  Bottom Layer w0.254: v1(21.77,51.11) v1(21.77,36.89)
I2C2_SDA: length 35.8
  Top Layer w0.254: v1(20.57,37.9) 21.18,37.29 21.18,33.99 23.92,31.25 U16.30 ; 20.52,55.33 20.57,55.27 v1(20.57,51.11)
  Bottom Layer w0.254: v1(20.57,51.11) v1(20.57,37.9)
INT1_ACC: length 24
  Top Layer w0.254: U16.24 32.16,34.25 32.08,34.17 v1(30.1,34.17) ; U1.16 16.99,42.76 17.27,42.47 18.54,42.47 18.8,42.22 18.8,39.43 19.56,38.66 22.35,38.66 23.37,37.65 23.37,36.25 v1(24.41,35.21)
  Bottom Layer w0.254: v1(24.41,35.21) 25.45,34.17 v1(30.1,34.17)
INT1_GYRO: length 23.9
  Top Layer w0.254: U16.25 32.84,33.75 32.59,33.5 29.3,33.5 26.42,36.38 26.42,41.2 22.84,44.78 19.54,44.78 18.95,45.37 U1.12
NRST: length 36.6
  Top Layer w0.254: v1(37.84,41.78) 37.5,42.12 35.66,42.12 32.77,45.01 32.77,47.74 37.91,52.89 R1.1 44.95,55.78 SW1.2 44.9,58.69 C7.2 ; v1(38.86,38.16) 40.39,38.16 40.75,38.52 U16.7
  Bottom Layer w0.254: v1(37.84,41.78) 38.35,41.27 38.35,38.66 v1(38.86,38.16)
OSC_IN: length 7.6
  Top Layer w0.254: X1.2 42.27,45.01 C9.1 41.75,42.67 U16.5
OSC_OUT: length 7.7
  Top Layer w0.254: X1.1 40.59,44.78 C12.1 41.25,42.54 U16.6
SBUS: length 2.9
  Top Layer w0.254: R15.2 75.04,11.29 U13.1
SPI1_MISO: length 15
  Top Layer w0.254: R4.1 24.38,38.54 24.38,36.12 25.02,35.49 v1(26.03,35.49) ; U16.22 31.35,35.25 31.12,35.49 v1(29.97,35.49)
  Bottom Layer w0.254: v1(26.03,35.49) v1(29.97,35.49)
SPI1_MOSI: length 19.2
  Top Layer w0.254: U16.23 29.06,34.75 27.18,36.63 27.18,41.67 R7.2
SPI1_SCK: length 20.7
  Top Layer w0.254: R9.1 27.94,43.74 27.94,37.39 28.96,36.38 30.99,36.38 31.62,35.75 U16.21
SWCLK: length 52.2
  Top Layer w0.254: U16.49 43.69,30.25 v1(43.69,30.26) ; U15.2 5.98,48.18 7.87,46.28 7.87,39.17 v1(8.89,38.16)
  Bottom Layer w0.254: v1(43.69,30.26) 43.21,30.26 41.15,32.31 24.38,32.31 18.54,38.16 v1(8.89,38.16)
SWDIO: length 51.4
  Top Layer w0.254: U16.46 42.75,31.96 v1(42.75,31.96) ; U15.3 6.47,46.93 7.11,46.28 v1(7.11,45.78)
  Bottom Layer w0.254: v1(42.75,31.96) 41.81,32.9 25.89,32.9 22.56,36.23 21.42,36.23 18.73,38.92 7.87,38.92 7.11,39.68 v1(7.11,45.78)
TIM2_CH1: length 51.6
  Top Layer w0.254: 2.62,28.89 2.62,28.89 H3.1 ; v1(39.62,31.3) 39.62,32.06 40.39,32.82 42.93,32.82 43.69,32.06 43.69,31.3 44.24,30.75 U16.50
  Bottom Layer w0.254: v1(39.62,31.3) 34.54,26.22 3.56,26.22 2.62,27.16 v1(2.62,28.78)
TIM2_CH2: length 47.1
  Top Layer w0.254: U16.55 39.8,33.25 38.61,32.06 38.61,31.42 ; H3.2 5.17,28.84 5.16,28.83
  Bottom Layer w0.254: v1(5.16,28.78) 5.16,27.67 5.92,26.9 34.34,26.9 v1(38.74,31.3)
TIM3_CH1: length 44
  Top Layer w0.254: U16.56 39.28,33.75 37.77,32.24 37.77,31.42 ; H3.3 7.7,28.84 7.67,28.81
  Bottom Layer w0.254: v1(37.85,31.3) 34.21,27.67 8.2,27.67 7.67,28.2 v1(7.67,28.78)
TIM3_CH2: length 40.7
  Top Layer w0.254: 36.96,31.42 36.96,32.19 39.02,34.25 U16.57 ; H3.4 10.25,28.8 v1(10.26,28.78)
  Bottom Layer w0.254: v1(10.26,28.78) 10.8,28.25 33.91,28.25 v1(36.96,31.3)
TIM5_CH1: length 22.1
  Top Layer w0.254: R14.2 49.88,44.61 v1(47.5,42.22) ; v1(38.1,37.65) 37.25,38.5 U16.14
  Bottom Layer w0.254: v1(38.1,37.65) 38.35,37.39 42.67,37.39 v1(47.5,42.22)
TIM8_CH2: length 17.3
  Top Layer w0.254: v1(38.76,26.14) 38.75,26.15 U16.38 ; R2.2 v1(27.18,21.99)
  Bottom Layer w0.254: v1(27.18,21.99) 34.61,21.99 v1(38.76,26.14)
USART1_RX: length 43.3
  Top Layer w0.254: v1(27.94,21.39) 25.15,18.6 12.19,18.6 9.56,21.23 U9.1 ; v1(40.89,23.93) 41.25,24.29 U16.43
  Bottom Layer w0.254: v1(40.89,23.93) 38.35,21.39 v1(27.94,21.39)
USART1_TX: length 43.7
  Top Layer w0.254: v1(28.45,20.63) 25.91,18.09 11.68,18.09 9.79,19.98 U9.2 ; U16.42 40.75,26.07 39.88,25.2 v1(39.88,21.65)
  Bottom Layer w0.254: v1(28.45,20.63) 38.86,20.63 v1(39.88,21.65)
USART2_RX: length 23.6
  Top Layer w0.254: U16.17 33.17,37.75 32.51,38.41 v1(32.51,38.92) ; v1(34.29,50.09) 38.45,54.25 38.45,55.12
  Bottom Layer w0.254: v1(32.51,38.92) 32.51,41.46 30.99,42.98 30.99,48.82 32.26,50.09 v1(34.29,50.09)
USART2_TX: length 19.9
  Top Layer w0.254: v1(34.8,40.44) 35.49,39.75 36.25,39.75 ; v1(31.78,43.78) 31.78,48.6 37.2,54.02 37.2,55.12
  Bottom Layer w0.254: v1(34.8,40.44) 31.78,43.46 v1(31.78,43.78)
USART3_RX: length 39.3
  Top Layer w0.254: v1(48.77,31.04) 48.06,31.75 U16.52 ; Q3.3 66.74,15.63 R13.1 66.74,16.63 v1(66.04,17.33)
  Bottom Layer w0.254: v1(48.77,31.04) 48.77,17.84 49.28,17.33 v1(66.04,17.33)
USART3_TX: length 45.9
  Top Layer w0.254: v1(70.1,16.31) 70.87,15.55 70.87,13.77 72,12.64 U13.2 ; U16.51 47.04,31.25 v1(48.01,30.28)
  Bottom Layer w0.254: v1(70.1,16.31) 48.77,16.31 48.01,17.07 v1(48.01,30.28)
USB_DM: length 25.8
  Top Layer w0.254: USB1.B7 39.13,12.77 40.13,13.77 ; U16.44 41.75,27 41.8,26.95 41.8,15.44 40.13,13.77 ; 40.13,13.77 USB1.A7
USB_DP: length 25.8
  Top Layer w0.254: USB1.A6 39.63,6.4 39.83,6.2 40.18,6.2 40.63,6.65 USB1.B6 40.63,13.69 42.2,15.27 42.2,26.95 42.25,27 U16.45
$1N19: length 4.6
  Top Layer w0.254: C18.2 31.49,30.02 32.22,30.75 U16.31
$1N20: length 5.7
  Top Layer w0.254: U16.47 43.25,26.66 44.7,25.2 46.8,25.2
$1N101: length 1.8
  Top Layer w0.254: Q3.1 68.98,11.29 R15.1
$1N156: length 1.8
  Top Layer w0.508: D1.1 R11.1
$1N7742: length 3.9
  Top Layer w0.254: 37.85,12.25 38.63,11.47 USB1.A5
$1N7746: length 3.9
  Top Layer w0.254: R17.1 41.63,11.45 USB1.B5
$1N8341: length 5
  Top Layer w0.254: U1.8 16.99,48.29 17.64,48.94 R9.2
$1N8349: length 2.9
  Top Layer w0.254: R7.1 19.98,46.87 U1.9
$1N8356: length 9.1
  Top Layer w0.254: U1.10 17.77,46.37 17.51,46.11 17.51,44.13 17.77,43.87 U1.15 19.18,43.87 19.45,43.6 19.45,41.06 20.32,40.19 R4.2
$1N8768: length 3.8
  Top Layer w0.254: U1.14 20.2,44.37 20.74,43.83 R5.1
$1N8804: length 2.8
  Top Layer w0.254: R6.2 13.05,45.87 U1.5
$1N9285: length 1.9
  Top Layer w0.254: R14.1 51.88,49.34 Q2.1
$1N9312: length 1.8
  Top Layer w0.508: Q2.3 52.83,55.22 R12.2
$1N9338: length 4.6
  Top Layer w0.508: D2.1 55.79,57.3 54.61,58.48 53.34,58.48 52.79,57.93 R12.1
$1N9545: length 1.7
  Top Layer w0.508: Q1.3 22.25,25.02 BUZZER1.2
$1N9603: length 4.5
  Top Layer w0.508: R3.2 26.3,24.05 Q1.1 24.25,24.05 23.31,23.11 R2.1

## Copper pours and planes (outline as drawn; the poured copper is in the pictures)
GND on Top Layer: -16,70.92 93.98,70.92 93.98,-5.02 -16,-5.02
GND on Bottom Layer: -5.84,63.56 85.34,63.56 85.34,-4.26 -5.84,-4.26
GND on Inner1: -6.6,66.1 87.88,66.1 87.88,-2.48 -6.6,-2.48
GND on Inner2: -3.81,62.79 81.79,62.79 81.79,-2.23 -3.81,-2.23
PGND on Top Layer: 57.4,60.51 57.4,48.32 67.82,37.9 82.8,37.9 82.8,42.22 80.77,44.25 75.69,44.25 72.14,47.81 72.14,60.51
VCC on Top Layer: 67.8,21.22 70.34,21.22 70.6,21.47 70.6,32.65 69.83,33.41 64.75,33.41 64.5,33.67 64.5,35.19 65.01,35.7 65.26,35.7 65.52,35.95 65.52,36.97 65.26,37.22 61.45,37.22 61.2,36.97 61.2,35.95 61.45,35.7 62.21,35.7 62.47,35.44 62.47,32.65 61.96,32.4 61.96,31.13 62.38,30.71 67.2,30.71 68.06,29.86 68.06,25.79 67.55,25.28 67.55,21.47
VCC on Top Layer: 38.1,5.78 41.91,5.78 41.91,4.12 38.1,4.12
VCC on Top Layer: 7.62,10.98 10.92,10.98 10.92,7.93 7.62,7.93
VCC on Inner2: 38.36,4.12 41.66,4.12 41.91,4.37 41.91,5.39 41.66,5.64 41.53,5.77 38.48,5.77 37.34,6.91 12.7,6.91 8.64,10.98 7.87,10.98 7.37,10.47 7.37,9.72 11.92,5.14 36.83,5.14
VCC on Inner2: 38.47,5.78 38.1,5.41 38.1,4.37 38.35,4.12 41.66,4.12 42.93,4.88 66.8,4.88 70.6,7.91 70.6,32.57 69.85,33.32 69.85,33.33 68.58,33.33 68.07,32.82 68.07,9.71 65.03,6.91 42.93,6.91 41.52,5.78 38.48,5.78
VCC on Inner2: 1.52,34.6 14.99,34.6 14.99,7.68 1.52,7.68
VCC3.3 on Top Layer: 53.09,33.33 60.19,33.33 60.19,19.36 53.09,19.36
VCC3.3 on Inner2: 58.67,33.58 58.93,33.33 58.93,32.06 58.68,31.81 56.13,31.81 51.55,36.12 23.37,36.12 20.15,39.53 6.1,39.53 5.08,40.7 5.08,42.73 5.59,43.24 6.35,43.24 6.86,42.73 6.86,41.46 7.37,40.95 20.83,40.95 24.38,37.14 53.07,37.14 56.64,33.58

Small or netless copper shapes (teardrops, artwork), in the pictures only: 341 on Top Layer, 49 on Bottom Layer, 6 on Inner2

## Text on the board
Bottom Silkscreen Layer: SDA | SCL | DIO | CLK | PA15 | PB3 | PB4 | PB5 | + | H | CAN2 | GND | VCC | L | SIGNAL | CAN1 | T | R | I2C1 | I2C2 | G | SBUS | SWD | USART1 | USART2
Top Silkscreen Layer: X | Y | GND | VCC | SIGNAL
